# Altium schematic sheet ALI SHEET.SchDoc
size A4
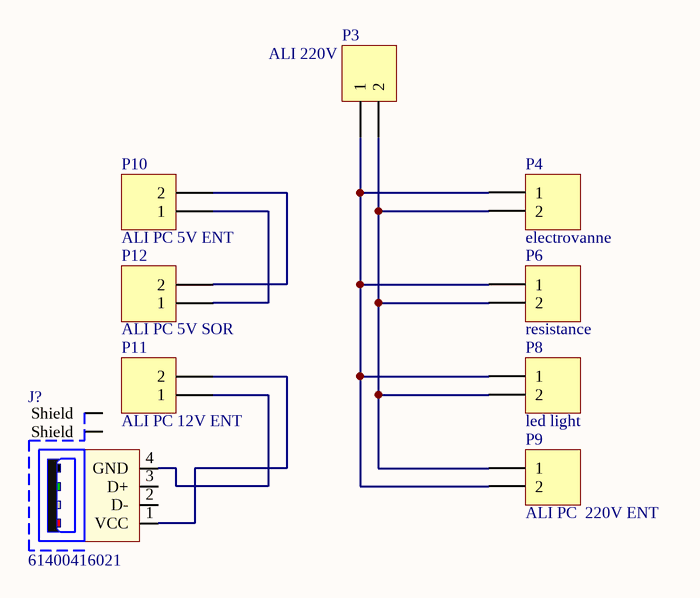
[diagram p0: ALI SHEET.SchDoc]

## Parts
J?  61400416021  [61400416021]
P3  ALI 220V  [HDR1X2]
P4  electrovanne  [HDR1X2]
P6  resistance  [HDR1X2]
P8  led light  [HDR1X2]
P9  ALI PC  220V ENT  [HDR1X2]
P10  ALI PC 5V ENT  [HDR1X2]
P11  ALI PC 12V ENT  [HDR1X2]
P12  ALI PC 5V SOR  [HDR1X2]

## Nets
NetJ?_1: J?.1(VCC) P11.2
NetJ?_4: J?.4(GND) P11.1
NetP3_1: P3.1 P4.1 P6.1 P8.1 P9.2
NetP3_2: P3.2 P4.2 P6.2 P8.2 P9.1
NetP10_1: P10.1 P12.1
NetP10_2: P10.2 P12.2

Not connected (* = marked no-connect by the designer): J? 2(D-) 3(D+) Z1(Shield) Z2(Shield)

## Library data of the parts
J? = 61400416021: WR-COM USB RA Type A; Manufacturer: Würth Elektronik eiSos GmbH; ComponentLink1 Description: Manufacturer; ComponentLink2 Description: Datasheet; NoPins: 4; ComponentLink1URL: http://www.we-online.de; ComponentLink2URL: http://katalog.we-online.de/em/datasheet/61400416021.pdf; Created by: Karrer Zheng; Created Date: 10/10/2014; partNo: 61400416021
P3 P4 P6 P8-P12 = Header 2: Header, 2-Pin; LatestRevisionDate: 17-Jul-2002; LatestRevisionNote: Re-released for DXP Platform.; Publisher: Altium Limited